# Altium schematic sheet graduation_project.SchDoc
size A4
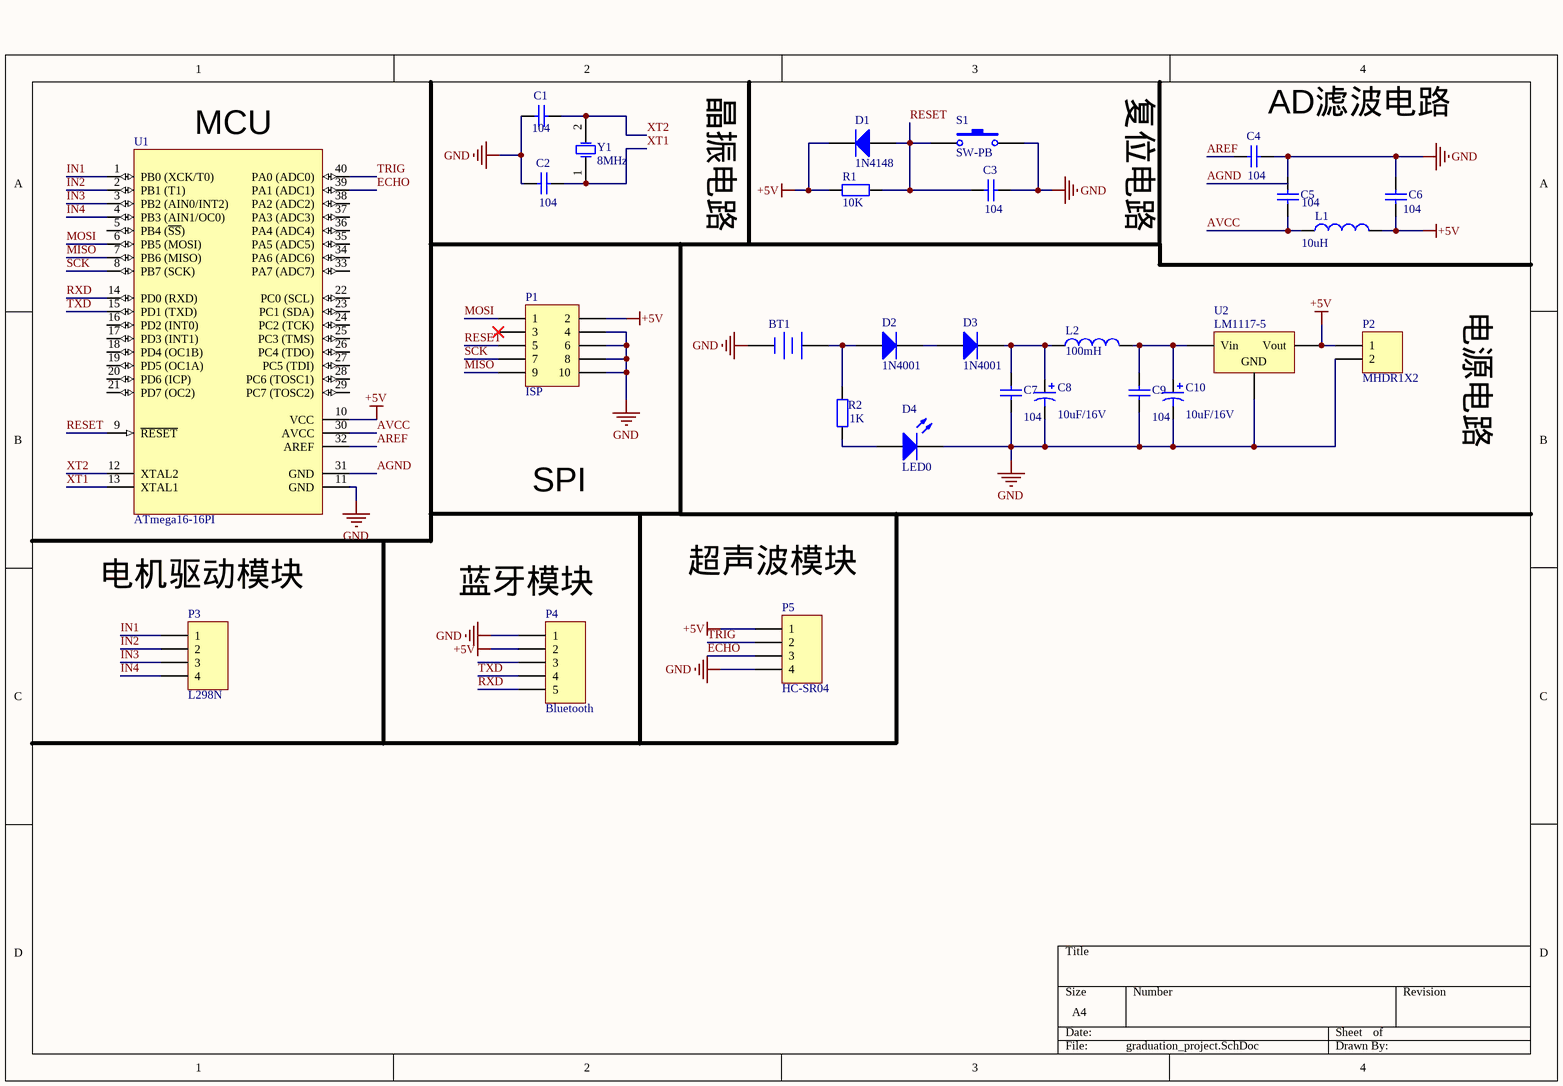
[diagram p0: graduation_project.SchDoc]

## Parts
BT1  Battery  [DC10B]  (value not drawn)
C1  value 104  [C0805]  (hidden comment: Cap)
C2  value 104  [C0805]  (hidden comment: Cap)
C3  value 104  [C0805]  (hidden comment: Cap)
C4  value 104  [C0805]  (hidden comment: Cap)
C5  value 104  [C0805]  (hidden comment: Cap)
C6  value 104  [C0805]  (hidden comment: Cap)
C7  value 104  [C0805]  (hidden comment: Cap)
C8  value 10uF/16V  [CAP5*5_4]  (hidden comment: Cap Pol3)
C9  value 104  [C0805]  (hidden comment: Cap)
C10  value 10uF/16V  [CAP5*5_4]  (hidden comment: Cap Pol3)
D1  1N4148  [1N4148-T]
D2  1N4001  [1N4148-T]
D3  1N4001  [1N4148-T]
D4  LED0  [LED1206]
L1  value 10uH  [R0805]  (hidden comment: Inductor)
L2  value 100mH  [R0805]  (hidden comment: Inductor)
P1  ISP  [MHDR2X5]
P2  MHDR1X2  [MHDR1X2]
P3  L298N  [MHDR1X4]
P4  Bluetooth  [MHDR1X5]
P5  HC-SR04  [MHDR1X4]
R1  value 10K  [R0805]  (hidden comment: Res2)
R2  value 1K  [R0805]  (hidden comment: Res2)
S1  SW-PB  [SWITCH]
U1  ATmega16-16PI  [40P6]
U2  LM1117-5  [SOT223]
Y1  8MHz  [XTAL]

## Nets
+5V: C6.2 D1.2(K) L1.2 P1.2 P2.1 P4.2 P5.1 R1.1 U1.10(VCC) U2.3(Vout)
GND: BT1.2(-) C1.1 C2.1 C3.2 C4.1 C5.1 C6.1 C7.1 C8.2 C9.1 C10.2 D4.2(K) P1.4 P1.6 P1.8 P1.10 P2.2 P4.1 P5.4 S1.2 U1.11(GND) U2.2(GND)
AGND: U1.31(GND)
AREF: C4.2 U1.32(AREF)
AVCC: C5.2 L1.1 U1.30(AVCC)
ECHO: P5.3 U1.39(PA1_(ADC1))
IN1: P3.1 U1.1(PB0_(XCK/T0))
IN2: P3.2 U1.2(PB1_(T1))
IN3: P3.3 U1.3(PB2_(AIN0/INT2))
IN4: P3.4 U1.4(PB3_(AIN1/OC0))
MISO: P1.9 U1.7(PB6_(MISO))
MOSI: P1.1 U1.6(PB5_(MOSI))
RESET: C3.1 D1.1(A) P1.5 R1.2 S1.1 U1.9(~{RESET})
RXD: P4.5 U1.14(PD0_(RXD))
SCK: P1.7 U1.8(PB7_(SCK))
TRIG: P5.2 U1.40(PA0_(ADC0))
TXD: P4.4 U1.15(PD1_(TXD))
XT1: C2.2 U1.13(XTAL1) Y1.1(OSC1)
XT2: C1.2 U1.12(XTAL2) Y1.2(OSC2)
NetBT1_1: BT1.1(+) D2.1(A) R2.1
NetC7_2: C7.2 C8.1 D3.2(K) L2.1
NetC9_2: C9.2 C10.1 L2.2 U2.1(Vin)
NetD2_2: D2.2(K) D3.1(A)
NetD4_1: D4.1(A) R2.2

Not connected (* = marked no-connect by the designer): P1 3*; P4 3; U1 5(PB4_(~{SS})) 16(PD2_(INT0)) 17(PD3_(INT1)) 18(PD4_(OC1B)) 19(PD5_(OC1A)) 20(PD6_(ICP)) 21(PD7_(OC2)) 22(PC0_(SCL)) 23(PC1_(SDA)) 24(PC2_(TCK)) 25(PC3_(TMS)) 26(PC4_(TDO)) 27(PC5_(TDI)) 28(PC6_(TOSC1)) 29(PC7_(TOSC2)) 33(PA7_(ADC7)) 34(PA6_(ADC6)) 35(PA5_(ADC5)) 36(PA4_(ADC4)) 37(PA3_(ADC3)) 38(PA2_(ADC2))

## Notes on the sheet
- 晶振电路
- 复位电路
- (near U1) MCU
- (near C4) AD滤波电路
- 电源电路
- SPI
- (near P3) 电机驱动模块
- (near P4) 蓝牙模块
- (near P5) 超声波模块

## Library data of the parts
BT1 = Battery: Multicell Battery; Published: 24-Mar-1999; LatestRevisionDate: 17-Jul-2002; LatestRevisionNote: Re-released for DXP Platform.; PackageReference: BAT-2; Publisher: Altium Limited
C1-C7 C9 = Cap: Capacitor; Published: 8-Jun-2000; LatestRevisionDate: 17-Jul-2002; LatestRevisionNote: Re-released for DXP Platform.; PackageReference: RAD-0.3; Publisher: Altium Limited
C8 C10 = Cap Pol3: Polarized Capacitor (Surface Mount); Published: 8-Jun-2000; LatestRevisionDate: 29-May-2009; LatestRevisionNote: IPC-7351 Footprint Added.; PackageReference: C0805; Publisher: Altium Limited; PackageDescription: Chip Capacitor
D1-D3 = Diode: Default Diode; Published: 8-Jun-2000; LatestRevisionDate: 17-Jul-2002; LatestRevisionNote: Re-released for DXP Platform.; PackageVersion: Sep-1996; PackageReference: SMC; Publisher: Altium Limited; Code_JEDEC: DO-214-AB
D4 = LED0: Typical INFRARED GaAs LED; Published: 8-Jun-2000; LatestRevisionDate: 08-Jul-2005; LatestRevisionNote: Mech Layer 1 removed.; PackageReference: LED-0; Publisher: Altium Limited
L1 L2 = Inductor: Code_IEC: 1005; Published: 8-Jun-2000; LatestRevisionDate: 29-May-2009; LatestRevisionNote: IPC-7351 Footprint Added.; PackageReference: 0402-A; Publisher: Altium Limited; PackageDescription: Chip Inductor; Code_JEITA: 0402
P1 = MHDR2X5: Header, 5-Pin, Dual row; LatestRevisionDate: 17-Jul-2002; LatestRevisionNote: Re-released for DXP Platform.; Publisher: Altium Limited
P2 = MHDR1X2: Header, 2-Pin; LatestRevisionDate: 17-Jul-2002; LatestRevisionNote: Re-released for DXP Platform.; Publisher: Altium Limited
P3 P5 = MHDR1X4: Header, 4-Pin; LatestRevisionDate: 17-Jul-2002; LatestRevisionNote: Re-released for DXP Platform.; Publisher: Altium Limited
P4 = MHDR1X5: Header, 5-Pin; LatestRevisionDate: 17-Jul-2002; LatestRevisionNote: Re-released for DXP Platform.; Publisher: Altium Limited
R1 R2 = Res2: Resistor; Published: 8-Jun-2000; LatestRevisionDate: 17-Jul-2002; LatestRevisionNote: Re-released for DXP Platform.; PackageReference: AXIAL-0.4; Publisher: Altium Limited
S1 = SW-PB: Switch; Published: 24-Mar-1999; LatestRevisionDate: 17-Jul-2002; LatestRevisionNote: Re-released for DXP Platform.; PackageReference: SPST-2; Publisher: Altium Limited
U1 = ATmega16-16PI: 8-Bit AVR Microcontroller with 16K Bytes of In-System Programmable Flash Memory; Published: 17-Sep-2003; LatestRevisionDate: 04-Mar-2005; LatestRevisionNote: Stylized 3D Model Added.; DatasheetVersion: 2466E-AVR-10/02; PackageVersion: Dec-1999; PackageReference: 40P6; Publisher: Altium Limited; PackageDescription: DIP; 40 Leads; Row Spacing 15.24 mm; Pitch 2.54 mm; ComponentLink1Description: Manufacturer Link; ComponentLink1URL: http://www.atmel.com; ComponentLink2Description: Datasheet; ComponentLink2URL: http://www.atmel.com/dyn/resources/prod_documents/doc2466.pdf
U2 = Volt Reg: Voltage Regulator; Published: 24-Mar-1999; LatestRevisionDate: 29-May-2009; LatestRevisionNote: IPC-7351 Footprint Added.; PackageReference: D2PAK; Publisher: Altium Limited; PackageDescription: 3-Pin Transistor Outline Package 2.54 mm Pitch, 15.1 mm Lead Span
Y1 = XTAL: Crystal Oscillator; Published: 8-Jun-2000; LatestRevisionDate: 17-Jul-2002; LatestRevisionNote: Re-released for DXP Platform.; PackageReference: R38; Publisher: Altium Limited